# Altium schematic sheet pai.SchDoc: Pai
size Tabloid; DrawnBy: Byrne; DocumentNumber: 1; SheetNumber: 1; SheetTotal: 1
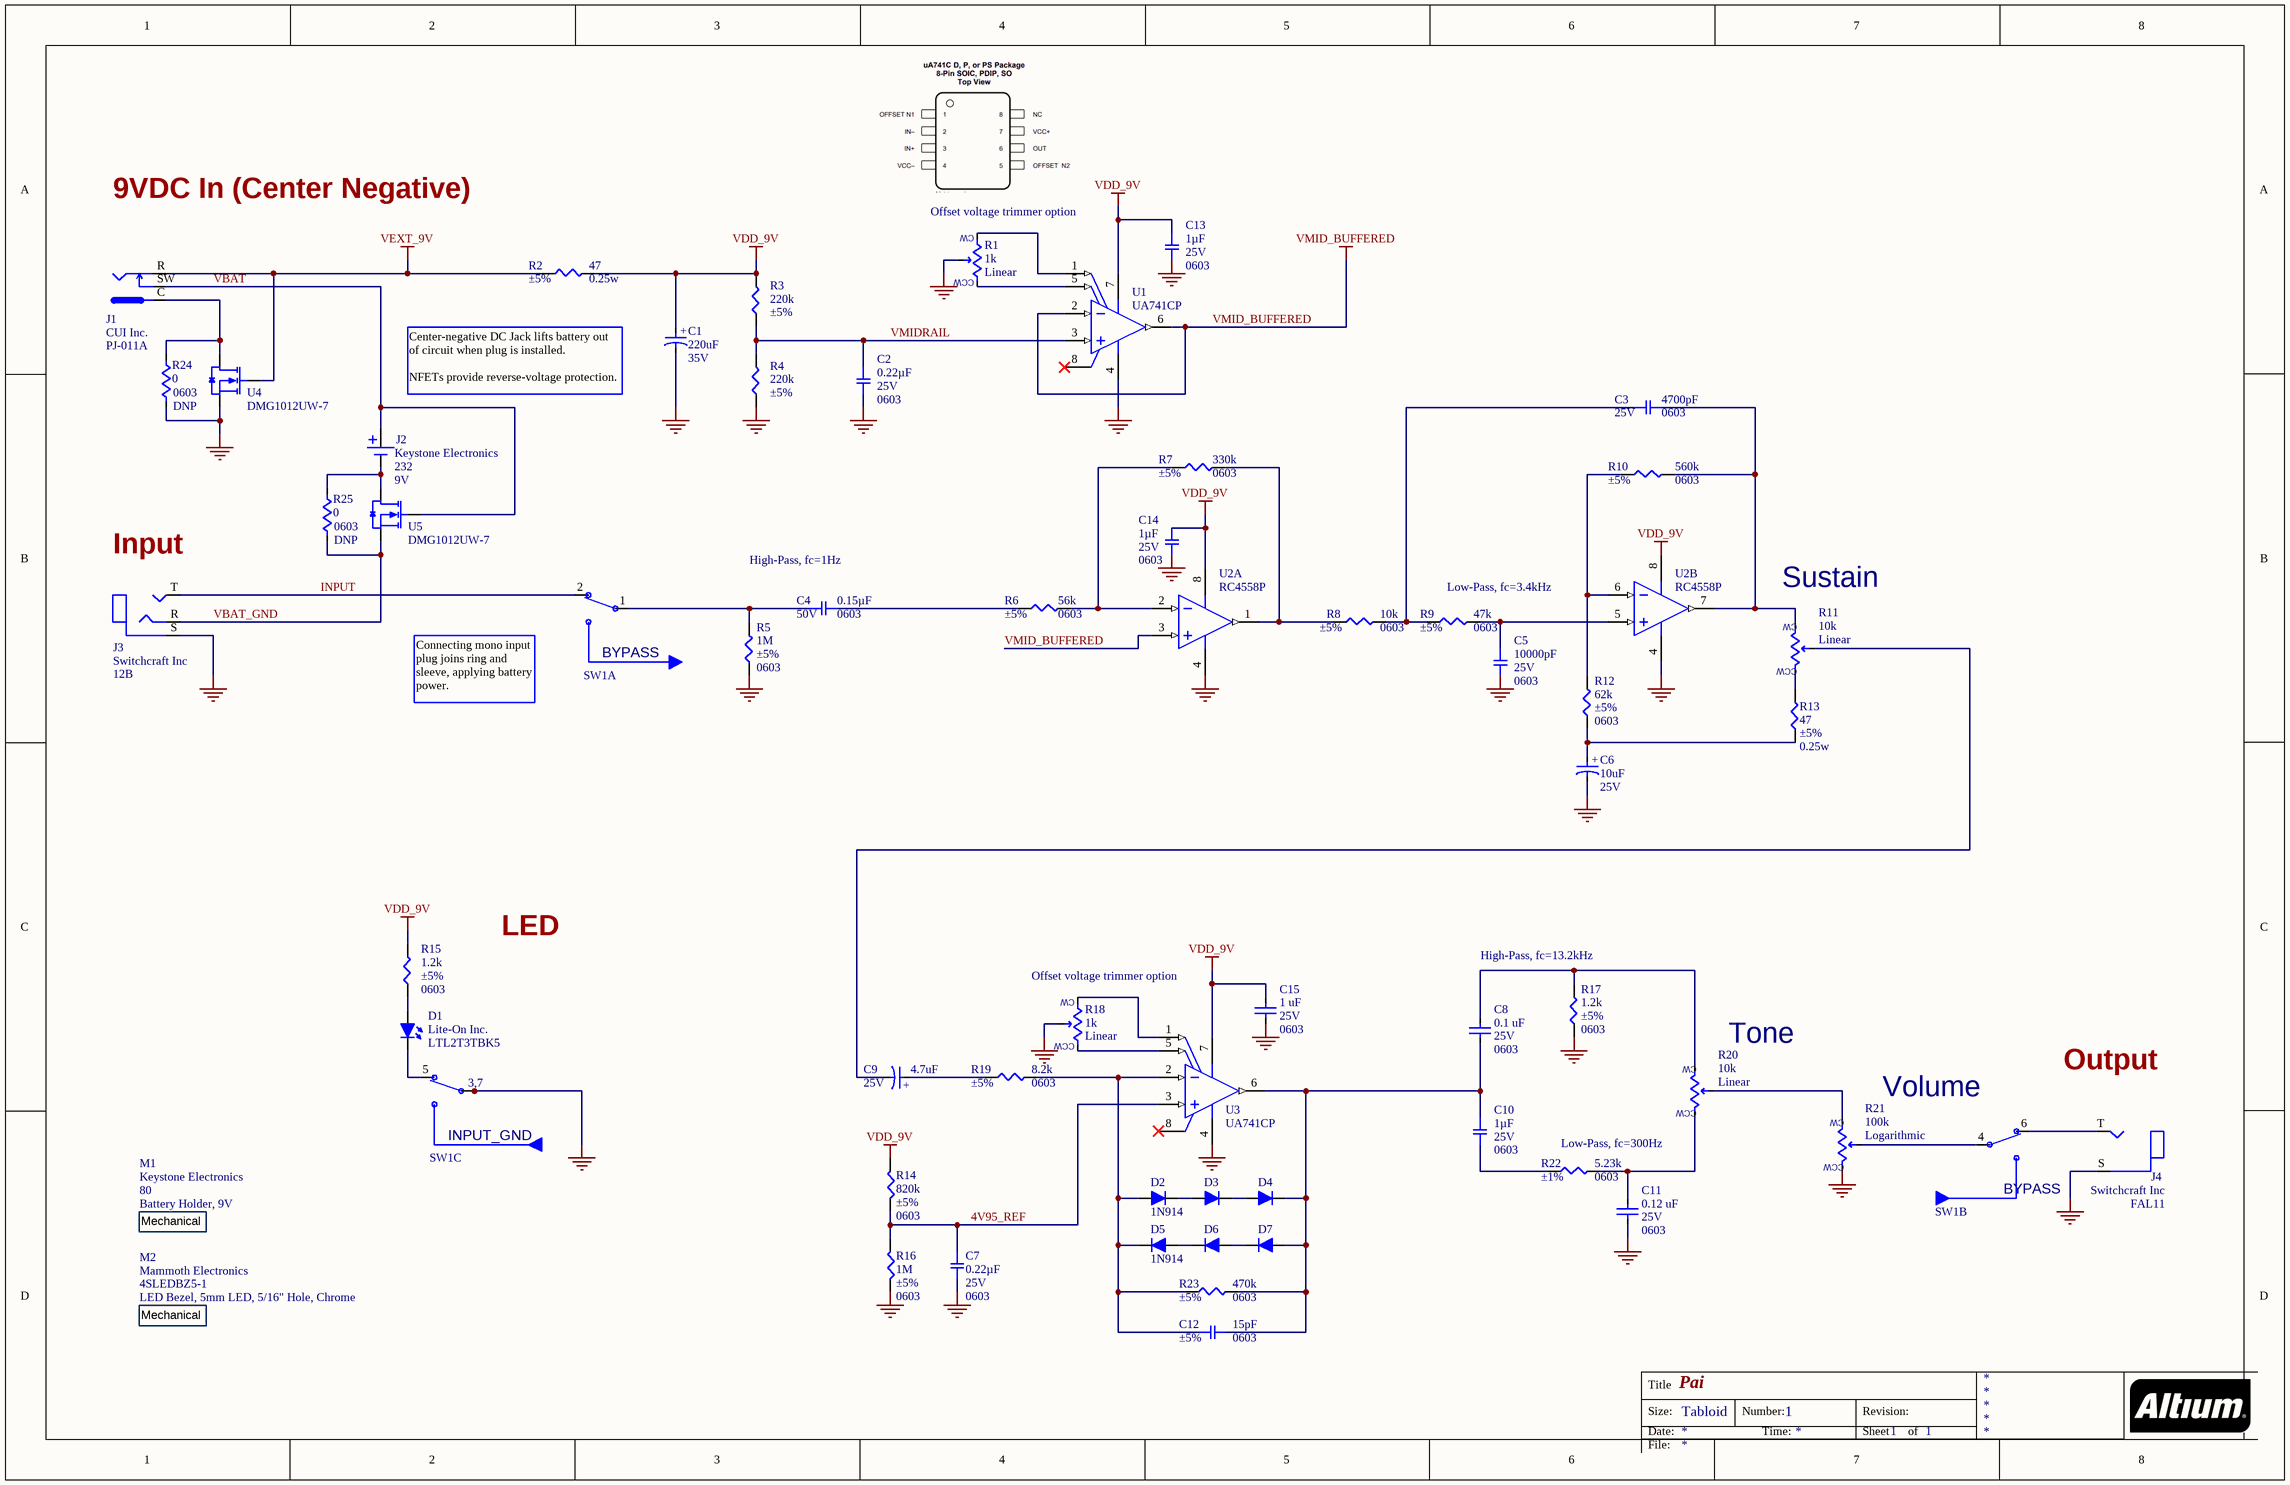
[diagram p0: pai.SchDoc]

## Parts
C1  value 220uF  Voltage-Rated: 35V  [CAP_TH_10X14_L5]  (hidden comment: CAP-POL)
C2  0.22µF  Voltage: 25V  Package / Case: 0603  [SMD-0603C]
C3  4700pF  Voltage: 25V  Package / Case: 0603  [SMD-0603C]
C4  0.15µF  Voltage: 50V  Package / Case: 0603  [SMD-0603C]
C5  10000pF  Voltage: 25V  Package / Case: 0603  [SMD-0603C]
C6  value 10uF  Voltage-Rated: 25V  [CAP_TH_5X12_L5]  (hidden comment: CAP-POL)
C7  0.22µF  Voltage: 25V  Package / Case: 0603  [SMD-0603C]
C8  value 0.1 uF  Voltage-Rated: 25V  Package / Case: 0603  [CAPC1608X09N]  (hidden comment: CAP)
C9  value 4.7uF  Voltage-Rated: 25V  [CAP_TH_5X12_L2]  (hidden comment: CAP-POL)
C10  1µF  Voltage: 25V  Package / Case: 0603  [SMD-0603C]
C11  value 0.12 uF  Voltage-Rated: 25V  Package / Case: 0603  [CAPC1608X09N]  (hidden comment: CAP)
C12  15pF  Tolerance: ±5%  Package / Case: 0603  [SMD-0603C]
C13  1µF  Voltage: 25V  Package / Case: 0603  [SMD-0603C]
C14  1µF  Voltage: 25V  Package / Case: 0603  [SMD-0603C]
C15  value 1 uF  Voltage-Rated: 25V  Package / Case: 0603  [CAPC1608X09N]  (hidden comment: CAP)
D1  Manufacturer 1: Lite-On Inc.  Manufacturer 1 PN: LTL2T3TBK5  [LED_TH_5MM_BLUE]  (hidden comment: LED-Blue)
D2  Manufacturer 1 PN: 1N914  [DO35-2_1N914]  (hidden comment: DIO-GEN)
D3  DIO-GEN  [DO35-2_1N914]  (value not drawn)
D4  DIO-GEN  [DO35-2_1N914]  (value not drawn)
D5  Manufacturer 1 PN: 1N914  [DO35-2_1N914]  (hidden comment: DIO-GEN)
D6  DIO-GEN  [DO35-2_1N914]  (value not drawn)
D7  DIO-GEN  [DO35-2_1N914]  (value not drawn)
J1  Manufacturer 1 PN: PJ-011A  Manufacturer 1: CUI Inc.  [PWR_JACK_SW_HDR]  (hidden comment: PWR_JACK_SW)
J2  Manufacturer 1 PN: 232  Battery Cell Size: 9V  Manufacturer 1: Keystone Electronics  [PWR_JACK_HDR]  (hidden comment: 9V_BATT)
J3  Manufacturer 1 PN: 12B  Manufacturer 1: Switchcraft Inc  [STEREO_JACK_HDR]  (hidden comment: STEREO_JACK)
J4  Manufacturer 1 PN: FAL11  Manufacturer 1: Switchcraft Inc  [MONO_JACK_HDR]  (hidden comment: MONO_JACK)
M1  Manufacturer 1 PN: 80  Manufacturer 1: Keystone Electronics  Desc: Battery Holder, 9V  (hidden comment: MECH)  (mechanical)
M2  Manufacturer 1 PN: 4SLEDBZ5-1  Supplier 1: Mammoth Electronics  (hidden comment: MECH)  (mechanical)
R1  value 1k  Taper: Linear  [POT_TT35W]  (hidden comment: POT)
R2  47  Tolerance: ±5%  Power (Watts): 0.25w  [SMD-0603-RES]
R3  220k  Tolerance: ±5%  [SMD-0603-RES]
R4  220k  Tolerance: ±5%  [SMD-0603-RES]
R5  1M  Tolerance: ±5%  Supplier Device Package: 0603  [SMD-0603-RES]
R6  56k  Tolerance: ±5%  Supplier Device Package: 0603  [SMD-0603-RES]
R7  330k  Tolerance: ±5%  Supplier Device Package: 0603  [SMD-0603-RES]
R8  10k  Tolerance: ±5%  Supplier Device Package: 0603  [SMD-0603-RES]
R9  47k  Tolerance: ±5%  Package / Case: 0603  [SMD-0603-RES]
R10  560k  Tolerance: ±5%  Supplier Device Package: 0603  [SMD-0603-RES]
R11  value 10k  Taper: Linear  [POT_16MM_TH_RA]  (hidden comment: POT)
R12  62k  Tolerance: ±5%  Supplier Device Package: 0603  [SMD-0603-RES]
R13  47  Tolerance: ±5%  Power (Watts): 0.25w  [SMD-0603-RES]
R14  820k  Tolerance: ±5%  Supplier Device Package: 0603  [SMD-0603-RES]
R15  1.2k  Tolerance: ±5%  Package / Case: 0603  [SMD-0603-RES]
R16  1M  Tolerance: ±5%  Supplier Device Package: 0603  [SMD-0603-RES]
R17  1.2k  Tolerance: ±5%  Supplier Device Package: 0603  [SMD-0603-RES]
R18  value 1k  Taper: Linear  [POT_TT35W]  (hidden comment: POT)
R19  8.2k  Tolerance: ±5%  Supplier Device Package: 0603  [SMD-0603-RES]
R20  value 10k  Taper: Linear  [POT_16MM_TH_RA]  (hidden comment: POT)
R21  value 100k  Taper: Logarithmic  [POT_16MM_TH_RA]  (hidden comment: POT)
R22  5.23k  Tolerance: ±1%  Supplier Device Package: 0603  [SMD-0603-RES]
R23  470k  Tolerance: ±5%  Supplier Device Package: 0603  [SMD-0603-RES]
R24  value 0  Package: 0603  [RESC1508X09N]  (hidden comment: RES)  (no BOM)
R25  value 0  Package: 0603  [RESC1508X09N]  (hidden comment: RES)  (no BOM)
SW1  3PDT_SW_SOLDERBOARD  (value not drawn)  (parts A,B,C of 3)
U1  UA741CP  [TI-P8]
U2  RC4558P  [TI-P8]  (parts A,B of 2)
U3  UA741CP  [TI-P8]
U4  Manufacturer Part Number: DMG1012UW-7  [SOT65P205X110-3N_DMG1012UW-7]  (hidden comment: NFET_SOT323)
U5  Manufacturer Part Number: DMG1012UW-7  [SOT65P205X110-3N_DMG1012UW-7]  (hidden comment: NFET_SOT323)

## Nets
GND: C1.2 C2.2 C5.2 C6.2 C7.2 C11.2 C13.2 C14.2 C15.2 J3.S J4.S R1.2 R4.1 R5.1 R16.1 R17.1 R18.2 R21.1 R24.1 SW1.3 SW1.7 U1.4(VCC-) U2.4(VCC-) U3.4(VCC-) U4.S
VDD_9V: C1.1 C13.1 C14.1 C15.1 R2.2 R3.2 R14.2 R15.2 U1.7(VCC+) U2.8(VCC+) U3.7(VCC+)
VEXT_9V: J1.R R2.1 U4.G
VMID_BUFFERED: U1.2(IN-) U1.6(OUT) U2.3(IN1+)
4V95_REF: C7.1 R14.1 R16.2 U3.3(IN+)
INPUT: J3.T SW1.2
VBAT: J1.SW J2.1 U5.G
VBAT_GND: J3.R R25.1 U5.S
VMIDRAIL: C2.1 R3.1 R4.2 U1.3(IN+)
NetC3_1: C3.1 R8.2 R9.1
NetC3_2: C3.2 R10.2 R11.3 U2.7(OUT2)
NetC4_1: C4.1 R5.2 SW1.1
NetC4_2: C4.2 R6.1
NetC5_1: C5.1 R9.2 U2.5(IN2+)
NetC6_1: C6.1 R12.1 R13.1
NetC8_1: C8.1 R17.2 R20.3
NetC8_2: C8.2 C10.1 C12.2 D4.K D7.A R23.2 U3.6(OUT)
NetC9_1: C9.1 R19.1
NetC9_2: C9.2 R11.2
NetC10_2: C10.2 R22.1
NetC11_1: C11.1 R20.1 R22.2
NetC12_1: C12.1 D2.A D5.K R19.2 R23.1 U3.2(IN-)
NetD1_A: D1.A R15.1
NetD1_K: D1.K SW1.5
NetD2_K: D2.K D3.A
NetD3_K: D3.K D4.A
NetD5_A: D5.A D6.K
NetD6_A: D6.A D7.K
NetJ1_C: J1.C R24.2 U4.D
NetJ2_2: J2.2 R25.2 U5.D
NetJ4_T: J4.T SW1.6
NetR1_1: R1.1 U1.5(OFFSET_N2)
NetR1_3: R1.3 U1.1(OFFSET_N1)
NetR6_2: R6.2 R7.1 U2.2(IN1-)
NetR7_2: R7.2 R8.1 U2.1(OUT1)
NetR10_1: R10.1 R12.2 U2.6(IN2-)
NetR11_1: R11.1 R13.2
NetR18_1: R18.1 U3.5(OFFSET_N2)
NetR18_3: R18.3 U3.1(OFFSET_N1)
NetR20_2: R20.2 R21.3
NetR21_2: R21.2 SW1.4

Not connected (* = marked no-connect by the designer): U1 8(NC)*; U3 8(NC)*

## Notes on the sheet
- 9VDC In (Center Negative)
- (near R1) Offset voltage trimmer option
- Center-negative DC Jack lifts battery out of circuit when plug is installed.
  NFETs provide reverse-voltage protection.
- (near J3) Input
- (near C4) High-Pass, fc=1Hz
- (near R9) Low-Pass, fc=3.4kHz
- (near R11) Sustain
- Connecting mono input plug joins ring and sleeve, applying battery power.
- LED
- (near R17) High-Pass, fc=13.2kHz
- (near R18) Offset voltage trimmer option
- (near R20) Tone
- Volume
- Output
- (near R22) Low-Pass, fc=300Hz
- Title
- Size:
- Date:
- Tabloid
- Number:
- Time:
- Revision:
- Sheet
- of
- File:
- (in symbol 3PDT_SW_SOLDERBOARD, part A) BYPASS
- (in symbol 3PDT_SW_SOLDERBOARD, part B) BYPASS
- (in symbol 3PDT_SW_SOLDERBOARD, part C) 3,7; INPUT_GND
- (in symbol CAP-TH-0001) +
- (in symbol CAP-TH-0002) +
- (in symbol CAP-TH-0003) +
- (in symbol MECH-0001) Mechanical
- (in symbol MECH-0002) Mechanical
- (in symbol POT-0004) CW; CCW
- (in symbol POT-0017) CW; CCW
- (in symbol POT-0021) CW; CCW

## Library data of the parts
C1 = CAP-TH-0002: CAP ALUM 220UF 20% 35V THRU HOLE; Manufacturer 1: KEMET; Manufacturer 1 PN: ESH227M035AH9AA; Lifetime @ Temp: 2000; Polarization: Polar; Ripple Current @ Low Frequency: 315Ma @ 120Hz; Ripple Current @ High Frequency: 472.5mA @ 10kHz; TPN: CAP-TH-0002; Tolerance: 20%; ESR: -; Operating Temperature: -40°C ~ 105°C; Lead Spacing: 0.197" (5.00mm); Size / Dimension: 0.394" Dia (10.00mm); Height - Seated (Max): 0.551" (14.00mm); Mounting Type: Through Hole; Package / Case: Radial, Can; Supplier 1: Digi-Key; Supplier 1 PN: 399-15681-ND; Supplier 1 Link: https://www.digikey.com/product-detail/en/kemet/ESH227M035AH9AA/399-15681-ND/7423187
C2 C7 = GRM188R71E224KA88D: CAP CER 0.22UF 25V X7R 0603; Manufacturer: Murata Electronics North America; Factory Stock: 0; Unit Price (USD): 0.14; Minimum Quantity: 1; Tolerance: ±10%; Part Number: GRM188R71E224KA88D; Datasheets: http://www.murata.com/~/media/webrenewal/support/library/catalog/products/capacitor/mlcc/c02e.pdf; Image: //media.digikey.com/Renders/Murata%20Renders/ZRB-SERIES-0402.jpg; Digi-Key Part Number: 490-3290-1-ND; Quantity Available: 323168; @ qty: 0; Packaging: Cut Tape (CT); Series: GRM; Part Status: Active; Value: 0.22µF; Temperature Coefficient: X7R; Operating Temperature: -55°C ~ 125°C; Features: -; Ratings: -; Applications: General Purpose; Mounting Type: Surface Mount, MLCC; Size / Dimension: 0.063" L x 0.031" W (1.60mm x 0.80mm); Height - Seated (Max): -; Thickness (Max): 0.035" (0.90mm); Lead Spacing: -; Lead Style: -
C3 = GCM188R71E472KA37D: CAP CER 4700PF 25V X7R 0603; Manufacturer: Murata Electronics North America; Factory Stock: 0; Unit Price (USD): 0.1; Minimum Quantity: 1; Tolerance: ±10%; Part Number: GCM188R71E472KA37D; Datasheets: http://www.murata.com/~/media/webrenewal/support/library/catalog/products/capacitor/mlcc/c03e.ashx; Image: //media.digikey.com/Renders/Murata%20Renders/0603%28GCM188%29.jpg; Digi-Key Part Number: 490-11959-1-ND; Quantity Available: 3228; @ qty: 0; Packaging: Cut Tape (CT); Series: GCM; Part Status: Active; Value: 4700pF; Temperature Coefficient: X7R; Operating Temperature: -55°C ~ 125°C; Features: -; Ratings: AEC-Q200; Applications: Automotive; Mounting Type: Surface Mount, MLCC; Size / Dimension: 0.063" L x 0.031" W (1.60mm x 0.80mm); Height - Seated (Max): -; Thickness (Max): 0.035" (0.90mm); Lead Spacing: -; Lead Style: -
C4 = GCM188R71H154KA64D: CAP CER 0.15UF 50V X7R 0603; Manufacturer: Murata Electronics North America; Factory Stock: 0; Unit Price (USD): 0.19; Minimum Quantity: 1; Tolerance: ±10%; Part Number: GCM188R71H154KA64D; Datasheets: http://www.murata.com/~/media/webrenewal/support/library/catalog/products/capacitor/mlcc/c03e.ashx; Image: //media.digikey.com/Renders/Murata%20Renders/0603%28GCM188%29.jpg; Digi-Key Part Number: 490-11960-1-ND; Quantity Available: 3950; @ qty: 0; Packaging: Cut Tape (CT); Series: GCM; Part Status: Active; Value: 0.15µF; Temperature Coefficient: X7R; Operating Temperature: -55°C ~ 125°C; Features: -; Ratings: AEC-Q200; Applications: Automotive; Mounting Type: Surface Mount, MLCC; Size / Dimension: 0.063" L x 0.031" W (1.60mm x 0.80mm); Height - Seated (Max): -; Thickness (Max): 0.035" (0.90mm); Lead Spacing: -; Lead Style: -; Parameter 1: *
C5 = GRM188R71E103KA01J: CAP CER 10000PF 25V X7R 0603; Manufacturer: Murata Electronics North America; Factory Stock: 0; Unit Price (USD): 0.1; Minimum Quantity: 1; Tolerance: ±10%; Part Number: GRM188R71E103KA01J; Datasheets: http://www.murata.com/~/media/webrenewal/support/library/catalog/products/capacitor/mlcc/c02e.pdf; Image: //media.digikey.com/Renders/Murata%20Renders/ZRB-SERIES-0402.jpg; Digi-Key Part Number: 490-11997-1-ND; Quantity Available: 8531; @ qty: 0; Packaging: Cut Tape (CT); Series: GRM; Part Status: Active; Value: 10000pF; Temperature Coefficient: X7R; Operating Temperature: -55°C ~ 125°C; Features: -; Ratings: -; Applications: General Purpose; Mounting Type: Surface Mount, MLCC; Size / Dimension: 0.063" L x 0.031" W (1.60mm x 0.80mm); Height - Seated (Max): -; Thickness (Max): 0.035" (0.90mm); Lead Spacing: -; Lead Style: -
C6 = CAP-TH-0001: CAP ALUM 10UF 20% 25V RADIAL; Manufacturer 1: Panasonic Electronic Components; Manufacturer 1 PN: ECA-1EM100B; Lifetime @ Temp: 2000; Polarization: Polar; Ripple Current @ Low Frequency: 50mA @ 120Hz; Ripple Current @ High Frequency: 85mA @ 10kHz; TPN: CAP-TH-0001; Tolerance: 20%; ESR: -; Operating Temperature: -40°C ~ 85°C; Lead Spacing: 0.197" (5.00mm); Size / Dimension: 0.197" Dia (5.00mm)); Height - Seated (Max): 0.472" (12.00mm); Mounting Type: Through Hole; Package / Case: Radial, Can; Supplier 1: Digi-Key; Supplier 1 PN: P19522CT-ND; Supplier 1 Link: https://www.digikey.com/product-detail/en/panasonic-electronic-components/ECA-1EM100B/P19522CT-ND/6109420
C8 = CAP-SMT-0001: CAP CER 0.1UF 25V X5R 0603; Manufacturer 1: Samsung Electro-Mechanics; Manufacturer Part Number 1: CL10A104KA8NNNC; Tolerance: 20%; TPN: CAP-SMT-0001; Temperature Coefficient: X5R; Operating Temperature: -55°C ~ 85°C; Size / Dimension: 0.063" L x 0.031" W (1.60mm x 0.80mm); Supplier 1: Digi-Key; Supplier Part Number 1: 1276-1857-1-ND; Supplier Link 1: http://www.samsungsem.com/kr/support/product-search/mlcc/CL10A104KA8NNNC.jsp; Manufacturer 2: Taiyo Yuden; Manufacturer Part Number 2: EMK107BJ104KAHT; Supplier 2: Digi-Key; Supplier Part Number 2: 587-3308-1-ND
C9 = CAP-TH-0003: CAP ALUM 4.7UF 20% 25V RADIAL; Manufacturer 1: Wurth Electronics Inc.; Manufacturer 1 PN: 860020472001; Lifetime @ Temp: 2000; Polarization: Polar; Ripple Current @ Low Frequency: 26mA @ 120Hz; Ripple Current @ High Frequency: 44.2mA @ 100kHz; TPN: CAP-TH-0003; Tolerance: 20%; ESR: -; Operating Temperature: -40°C ~ 105°C; Lead Spacing: 0.079" (2.00mm); Size / Dimension: 0.1o97" Dia (5.00mm); Height - Seated (Max): 0.492"(12.5mm); Mounting Type: Through Hole; Package / Case: Radial, Can; Supplier 1: Digi-Key; Supplier 1 PN: 732-8818-1-ND; Supplier 1 Link: https://www.digikey.com/product-detail/en/wurth-electronics-inc/860020472001/732-8818-1-ND/5728763
C10 C13 C14 = GRM188R71E105KA12D: CAP CER 1UF 25V X7R 0603; Manufacturer: Murata Electronics North America; Factory Stock: 0; Unit Price (USD): 0.24; Minimum Quantity: 1; Tolerance: ±10%; Part Number: GRM188R71E105KA12D; Datasheets: http://www.murata.com/~/media/webrenewal/support/library/catalog/products/capacitor/mlcc/c02e.pdf; Image: //media.digikey.com/Renders/Murata%20Renders/ZRB-SERIES-0402.jpg; Digi-Key Part Number: 490-5307-1-ND; Quantity Available: 513860; @ qty: 0; Packaging: Cut Tape (CT); Series: GRM; Part Status: Active; Value: 1µF; Temperature Coefficient: X7R; Operating Temperature: -55°C ~ 125°C; Features: -; Ratings: -; Applications: General Purpose; Mounting Type: Surface Mount, MLCC; Size / Dimension: 0.063" L x 0.031" W (1.60mm x 0.80mm); Height - Seated (Max): -; Thickness (Max): 0.035" (0.90mm); Lead Spacing: -; Lead Style: -
C11 = CAP-SMT-0002: CAP CER 0.12UF 25V X7R 0603; Manufacturer 1: Kemet; Manufacturer Part Number 1: C0603C124K3RAC7867; Tolerance: 10%; TPN: CAP-SMT-0002; Temperature Coefficient: X7R; Operating Temperature: -55°C ~ 125°C; Size / Dimension: 0.063" L x 0.031" W (1.60mm x 0.80mm); Supplier 1: Digi-Key; Supplier Part Number 1: 399-14951-1-ND; Supplier Link 1: https://api.kemet.com/component-edge/download/datasheet/C0603C124K3RAC7867.pdf
C12 = GCM1885C1H150JA16D: CAP CER 15PF 50V NP0 0603; Manufacturer: Murata Electronics North America; Factory Stock: 0; Unit Price (USD): 0.1; Minimum Quantity: 1; Temperature Coefficient: C0G, NP0; Part Number: GCM1885C1H150JA16D; Datasheets: http://www.murata.com/~/media/webrenewal/support/library/catalog/products/capacitor/mlcc/c03e.ashx; Image: //media.digikey.com/Renders/Murata%20Renders/0603%28GCM188%29.jpg; Digi-Key Part Number: 490-4957-1-ND; Quantity Available: 99209; @ qty: 0; Packaging: Cut Tape (CT); Series: GCM; Part Status: Active; Value: 15pF; Voltage: 50V; Operating Temperature: -55°C ~ 125°C; Features: -; Ratings: AEC-Q200; Applications: Automotive; Mounting Type: Surface Mount, MLCC; Size / Dimension: 0.063" L x 0.031" W (1.60mm x 0.80mm); Height - Seated (Max): -; Thickness (Max): 0.035" (0.90mm); Lead Spacing: -; Lead Style: -
C15 = CAP-SMT-0003: CAP CER 1UF 25V X5R 0603; Manufacturer 1: Samsung Electro-Mechanics; Manufacturer Part Number 1: CL10A15KA5LNNC; Tolerance: 10%; TPN: CAP-SMT-0003; Temperature Coefficient: X5R; Operating Temperature: -55°C ~ 85°C; Size / Dimension: 0.063" L x 0.031" W (1.60mm x 0.80mm); Supplier 1: Digi-Key; Supplier Part Number 1: 1276-1858-1-ND; Supplier Link 1: http://www.samsungsem.com/kr/support/product-search/mlcc/CL10A105KA5LNNC.jsp; Manufacturer 2: Taiyo Yuden; Manufacturer Part Number 2: TMK107B7105KA-T; Supplier 2: Digi-Key; Supplier Part Number 2: 587-2984-1-ND
D1 = LED-0003: LED BLUE CLEAR T-1 3/4 T/H; Configuration: Standard; Lens Color: Colorless; Millicandela Rating: 1200mcd; Lens Style: Round with Domed Top; Lens Size: 5mm, T-1 3/4; Voltage - Forward (Vf) (Typ): 3.5V; Current - Test: 20mA; Viewing Angle: 30°; Wavelength - Dominant: 470nm; Wavelength - Peak: 468nm; TPN: LED-0003; Color: Blue; Lens Transparency: Clear; Mounting Type: Through Hole; Features: -; Package / Case: Radial; Supplier Device Package: T-1 3/4; Size / Dimension: -; Height (Max): 8.70mm; Supplier 1: Digi-Key; Supplier 1 PN: 160-1610-ND; Supplier 1 Link: https://www.digikey.com/product-detail/en/lite-on-inc/LTL2T3TBK5/160-1610-ND/573515
D2 D5 = DIO-GEN-0001: DIODE GEN PURP 75V 200MA DO35; Manufacturer 1: Microsemi Corporation; Voltage - Forward (Vf) (Max) @ If: 1.2V @ 50mA; Speed: Small Signal =< 200mA (Io), Any Speed; Current - Reverse Leakage @ Vr: 500nA @ 75V; Capacitance @ Vr, F: 4pF @ 0V, 1MHz; TPN: DIO-GEN-0001; Voltage - DC Reverse (Vr) (Max): 75V; Current - Average Rectified (Io): 200mA; Mounting Type: Through Hole; Package / Case: DO-204AH, DO-35, Axial; Supplier Device Packaging: DO-35 (DO-204AH); Operating Temperature - Junction: -65°C ~ 175°C; Supplier 1: Digi-Key; Supplier 1 PN: 1N914MS-ND; Supplier 1 Link: https://www.digikey.com/product-detail/en/microsemi-corporation/1N914/1N914MS-ND/4377361
D3 D4 D6 D7 = DIO-GEN-0001: DIODE GEN PURP 75V 200MA DO35; Manufacturer 1 PN: 1N914; Manufacturer 1: Microsemi Corporation; Voltage - Forward (Vf) (Max) @ If: 1.2V @ 50mA; Speed: Small Signal =< 200mA (Io), Any Speed; Current - Reverse Leakage @ Vr: 500nA @ 75V; Capacitance @ Vr, F: 4pF @ 0V, 1MHz; TPN: DIO-GEN-0001; Voltage - DC Reverse (Vr) (Max): 75V; Current - Average Rectified (Io): 200mA; Mounting Type: Through Hole; Package / Case: DO-204AH, DO-35, Axial; Supplier Device Packaging: DO-35 (DO-204AH); Operating Temperature - Junction: -65°C ~ 175°C; Supplier 1: Digi-Key; Supplier 1 PN: 1N914MS-ND; Supplier 1 Link: https://www.digikey.com/product-detail/en/microsemi-corporation/1N914/1N914MS-ND/4377361
J1 = PWR-CN-0001: CONN PWR JACK 2X5.5MM SOLDER; Gender: Male; Industry Recognized Mating Diamter: 2.10mm ID (0.083"), 5.50mm OD (0.217"); Actual Diameter: 0.079" (2.00mm ID), 0.236" (6.00mm OD); Number of Positions/Contacts: 2 Conductors, 3 Contacts; Internal Switch(s): Single Switch, Normally Closed; Shielding: Unshielded; Voltage - Rated: 12VDC; Current Rating: 2A; Includes: 2 pcs - 1 Connector, 1 Nut; Body Color: Black; Material Flammability Rating: UL94 V-0; TPN: PWR-CN-0001; Connector Type: Jack; Mounting Type: Panel Mount; Mounting Feature: Bulkhead - Front Side Nut; Termination: Solder Eyelet(s); Features: Mounting Hardware, Thread Lock; Insulation Color: -; Mating Length / Depth: -; Ingress Protection: -; Contact Material - Plating: Nickel; Body Material: -; Operating Temperature: -; Housing Material: Polyoxymethylene (POM); Contact Material: Brass; Copper Alloy; Thread Size: -; Supplier 1: Digi-Key; Supplier 1 PN: CP-011A-ND; Supplier 1 Link: https://www.digikey.com/product-detail/en/cui-inc/PJ-011A/CP-011A-ND/305540
J2 = BATT-0001: BATTERY CONNECT SNAP 9V 4" LEADS; Battery Type Function: 9; Style: Connector, Snap; Number of Cells: 1; TPN: BATT-0001; Battery Series: -; Mounting Type: Free Hanging; Termination Style: Wire Leads - 4" (101.6mm); Height Above Board: -; Operating Temperature: -; Supplier 1: Digi-Key; Supplier 1 PN: 36-232-ND; Supplier 1 Link: https://www.digikey.com/product-detail/en/keystone-electronics/232/36-232-ND/303804
J3 = AUD-CN-0001: CONN JACK STEREO 6.35MM PNL MNT; Manufacturer 2 PN: JK100S; Connector Type: Phone Jack; Gender: Female; Singal Lines: Stereo (3 Conductor, TRS); Industry Recognized Mating Diameter: 6.35mm (0.250", 1/4") - Headphone; Actual Diameter: 0.25" (6.35mm); Number of Positions/Contacts: 3 Conductors, 3 Contacts; Internal Switch(s): Does Not Contain Switch; Shielding: Unshielded; Voltage - Rated: 25VDC; Current Rating: 1A; Body Material: Copper Alloy; Body Color: Silver; Includes: 3 pcs - 1 Connector, 1 Nut, 1 Washer; Panel Hole Size: 0.375" (9.52mm); Thread Size: 3/8"-32; TPN: AUD-CN-0001; Series: LITTLE-JAX; Mounting Type: Panel Mount, Through Hole; Termination: Solder Eyelet(s); Features: Mounting Hardware, Thread Lock; Insulation Color: -; mating Length/Depth: -; Contact Material - Plating: Nickel; Housing Material: -; Contact Material: Copper Alloy; Cable Opening: -; Operating Temperature: -20°C ~ 65°C; Supplier 1: Digi-Key; Supplier 1 PN: SC1094-ND; Supplier 1 Link: https://www.digikey.com/product-detail/en/switchcraft-inc/12B/SC1094-ND/109541; Manufacturer 2: Mammoth Electronics; Supplier 2: https://www.mammothelectronics.com/collections/audio-jacks/products/4sjk100s
J4 = AUD-CN-0002: CONN JACK MONO 6.35MM PNL MNT; Manufacturer 2 PN: JK100M; Connector Type: Phone Jack; Gender: Female; Industry Recognized Mating Diameter: 6.35mm (0.250", 1/4") - Headphone; Actual Diameter: 0.25" (6.35mm); Number of Positions/Contacts: 2 Conductors, 2 Contacts; Internal Switch(s): Does Not Contain Switch; Shielding: Unshielded; Voltage - Rated: 25VDC; Current Rating: 1A; Body Material: Copper Alloy; Body Color: Silver; Includes: 3 pcs - 1 Connector, 1 Nut, 1 Washer; Panel Hole Size: 0.375" (9.52mm); Thread Size: 3/8"-32; TPN: AUD-CN-0002; Series: LITTLE-JAX; Singal Lines: Mono; Mounting Type: Panel Mount, Through Hole; Termination: Solder Eyelet(s); Features: Mounting Hardware, Thread Lock; Insulation Color: -; mating Length/Depth: -; Contact Material - Plating: Nickel; Housing Material: -; Contact Material: Copper Alloy; Cable Opening: -; Operating Temperature: -20°C ~ 65°C; Supplier 1: Digi-Key; Supplier 1 PN: SC1847-ND; Supplier 1 Link: https://www.digikey.com/product-detail/en/switchcraft-inc/FAL11/SC1847-ND/1289066; Manufacturer 2: Mammoth Electronics; Supplier 2: https://www.mammothelectronics.com/collections/audio-jacks/products/4sjk100m
M1 = MECH-0001: BATTERY HOLDER CLIP 9V; TPN: MECH-0001; Supplier 1: Digi-Key; Supplier 1 PN: 36-80-ND; Supplier 1 Link: https://www.digikey.com/product-detail/en/keystone-electronics/80/36-80-ND/2745547
M2 = MECH-0002: LED Bezel, 5mm LED, 5/16" Hole, Chrome; TPN: MECH-0002; Manufacturer 1: Mammoth Electronics; Supplier 1 PN: 4SLEDBZ5-1; Supplier 1 Link: https://www.mammothelectronics.com/collections/led-bezels/products/4sledbz5-1; Desc: LED Bezel, 5mm LED, 5/16" Hole, Chrome
R1 R18 = POT-0021: Potentiometer, 1k, Linear Taper, Trim, Single Gang, Surface Mount; Manufacturer 1: TT Elecronics/Bl; Manufacturer 1 PN: 35WR1KLFTR; Tolerance: 25%; Power (Watts): 0.1; Temperature Coefficient: ±250ppm/°C; TPN: POT-0021; Size / Dimension: Rectangular - 0.144" x 0.118" Face x 0.067" H (3.65mm x 3.00mm x 1.70mm); Mounting Type: Surface Mount; Supplier 1: Digi-Key; Supplier Part Number 1: 987-1812-1-ND; Supplier Link 1: https://www.digikey.com/product-detail/en/tt-electronics-bi/35WR1KLFTR/987-1812-1-ND/8111752
R2 R13 = ERJ-PA3J470V: RES SMD 47 OHM 5% 1/4W 0603; Manufacturer: Panasonic Electronic Components; Factory Stock: 0; Unit Price (USD): 0.01646; @ qty: 1500; Minimum Quantity: 1; Temperature Coefficient: ±200ppm/°C; Part Number: ERJ-PA3J470V; Datasheets: https://industrial.panasonic.com/cdbs/www-data/pdf/RDA0000/AOA0000C243.pdf; Image: //media.digikey.com/Photos/Panasonic%20Photos/MFG_ERJ-P6W%20Series.jpg; Digi-Key Part Number: P47.00BZCT-ND; Quantity Available: 4817; Packaging: Cut Tape (CT); Series: ERJ; Part Status: Active; Value: 47; Composition: Thick Film; Features: Automotive AEC-Q200, Pulse Withstanding; Operating Temperature: -55°C ~ 155°C; Package / Case: 0603 (1608 Metric); Supplier Device Package: 0603; Size / Dimension: 0.063" L x 0.031" W (1.60mm x 0.80mm); Height - Seated (Max): 0.022" (0.55mm); Number of Terminations: 2; Failure Rate: -
R3 = ERJ-PA3J224V: RES SMD 220K OHM 5% 1/4W 0603; Manufacturer: Panasonic Electronic Components; Factory Stock: 0; Unit Price (USD): 0.01646; @ qty: 1500; Minimum Quantity: 1; Power (Watts): 0.25W; Temperature Coefficient: ±200ppm/°C; Part Number: ERJ-PA3J224V; Datasheets: https://industrial.panasonic.com/cdbs/www-data/pdf/RDA0000/AOA0000C243.pdf; Image: //media.digikey.com/Photos/Panasonic%20Photos/MFG_ERJ-P6W%20Series.jpg; Digi-Key Part Number: P220KBZCT-ND; Quantity Available: 19215; Packaging: Cut Tape (CT); Series: ERJ; Part Status: Active; Value: 220k; Composition: Thick Film; Features: Automotive AEC-Q200, Pulse Withstanding; Operating Temperature: -55°C ~ 155°C; Package / Case: 0603 (1608 Metric); Supplier Device Package: 0603; Size / Dimension: 0.063" L x 0.031" W (1.60mm x 0.80mm); Height - Seated (Max): 0.022" (0.55mm); Number of Terminations: 2; Failure Rate: -
R4 = ERJ-PA3J224V: RES SMD 220K OHM 5% 1/4W 0603; Manufacturer: Panasonic Electronic Components; Factory Stock: 0; Unit Price (USD): 0.01646; @ qty: 1500; Minimum Quantity: 1; Power (Watts): 0.25W, 1/4W; Temperature Coefficient: ±200ppm/°C; Part Number: ERJ-PA3J224V; Datasheets: https://industrial.panasonic.com/cdbs/www-data/pdf/RDA0000/AOA0000C243.pdf; Image: //media.digikey.com/Photos/Panasonic%20Photos/MFG_ERJ-P6W%20Series.jpg; Digi-Key Part Number: P220KBZCT-ND; Quantity Available: 19215; Packaging: Cut Tape (CT); Series: ERJ; Part Status: Active; Value: 220k; Composition: Thick Film; Features: Automotive AEC-Q200, Pulse Withstanding; Operating Temperature: -55°C ~ 155°C; Package / Case: 0603 (1608 Metric); Supplier Device Package: 0603; Size / Dimension: 0.063" L x 0.031" W (1.60mm x 0.80mm); Height - Seated (Max): 0.022" (0.55mm); Number of Terminations: 2; Failure Rate: -
R5 R16 = ERJ-3GEYJ105V: RES SMD 1M OHM 5% 1/10W 0603; Manufacturer: Panasonic Electronic Components; Factory Stock: 0; Unit Price (USD): 0.00321; @ qty: 1500; Minimum Quantity: 1; Power (Watts): 0.1W, 1/10W; Temperature Coefficient: ±200ppm/°C; Part Number: ERJ-3GEYJ105V; Datasheets: http://industrial.panasonic.com/www-cgi/jvcr13pz.cgi?E+PZ+3+AOA0001+ERJ3GEYJ105V+7+WW; Image: //media.digikey.com/Photos/Panasonic%20Photos/MFG_ERJ-P6W%20Series.jpg; Digi-Key Part Number: P1.0MGCT-ND; Quantity Available: 250051; Packaging: Cut Tape (CT); Series: ERJ; Part Status: Active; Value: 1M; Composition: Thick Film; Features: Automotive AEC-Q200; Operating Temperature: -55°C ~ 155°C; Package / Case: 0603 (1608 Metric); Size / Dimension: 0.063" L x 0.031" W (1.60mm x 0.80mm); Height - Seated (Max): 0.022" (0.55mm); Number of Terminations: 2; Failure Rate: -
R6 = ERJ-3GEYJ563V: RES SMD 56K OHM 5% 1/10W 0603; Manufacturer: Panasonic Electronic Components; Factory Stock: 0; Unit Price (USD): 0.00321; @ qty: 1500; Minimum Quantity: 1; Power (Watts): 0.1W, 1/10W; Temperature Coefficient: ±200ppm/°C; Part Number: ERJ-3GEYJ563V; Datasheets: http://industrial.panasonic.com/www-cgi/jvcr13pz.cgi?E+PZ+3+AOA0001+ERJ3GEYJ563V+7+WW; Image: //media.digikey.com/Photos/Panasonic%20Photos/MFG_ERJ-P6W%20Series.jpg; Digi-Key Part Number: P56KGCT-ND; Quantity Available: 76734; Packaging: Cut Tape (CT); Series: ERJ; Part Status: Active; Value: 56k; Composition: Thick Film; Features: Automotive AEC-Q200; Operating Temperature: -55°C ~ 155°C; Package / Case: 0603 (1608 Metric); Size / Dimension: 0.063" L x 0.031" W (1.60mm x 0.80mm); Height - Seated (Max): 0.022" (0.55mm); Number of Terminations: 2; Failure Rate: -
R7 = ERJ-3GEYJ334V: RES SMD 330K OHM 5% 1/10W 0603; Manufacturer: Panasonic Electronic Components; Factory Stock: 0; Unit Price (USD): 0.00321; @ qty: 1500; Minimum Quantity: 1; Power (Watts): 0.1W, 1/10W; Temperature Coefficient: ±200ppm/°C; Part Number: ERJ-3GEYJ334V; Datasheets: http://industrial.panasonic.com/www-cgi/jvcr13pz.cgi?E+PZ+3+AOA0001+ERJ3GEYJ334V+7+WW; Image: //media.digikey.com/Photos/Panasonic%20Photos/MFG_ERJ-P6W%20Series.jpg; Digi-Key Part Number: P330KGCT-ND; Quantity Available: 347903; Packaging: Cut Tape (CT); Series: ERJ; Part Status: Active; Value: 330k; Composition: Thick Film; Features: Automotive AEC-Q200; Operating Temperature: -55°C ~ 155°C; Package / Case: 0603 (1608 Metric); Size / Dimension: 0.063" L x 0.031" W (1.60mm x 0.80mm); Height - Seated (Max): 0.022" (0.55mm); Number of Terminations: 2; Failure Rate: -
R8 = ERJ-3GEYJ103V: RES SMD 10K OHM 5% 1/10W 0603; Manufacturer: Panasonic Electronic Components; Factory Stock: 0; Unit Price (USD): 0.00321; @ qty: 1500; Minimum Quantity: 1; Power (Watts): 0.1W, 1/10W; Temperature Coefficient: ±200ppm/°C; Part Number: ERJ-3GEYJ103V; Datasheets: http://industrial.panasonic.com/www-cgi/jvcr13pz.cgi?E+PZ+3+AOA0001+ERJ3GEYJ103V+7+WW; Image: //media.digikey.com/Photos/Panasonic%20Photos/MFG_ERJ-P6W%20Series.jpg; Digi-Key Part Number: P10KGCT-ND; Quantity Available: 7178118; Packaging: Cut Tape (CT); Series: ERJ; Part Status: Active; Value: 10k; Composition: Thick Film; Features: Automotive AEC-Q200; Operating Temperature: -55°C ~ 155°C; Package / Case: 0603 (1608 Metric); Size / Dimension: 0.063" L x 0.031" W (1.60mm x 0.80mm); Height - Seated (Max): 0.022" (0.55mm); Number of Terminations: 2; Failure Rate: -
R9 = ERJ-3GEYJ473V: RES SMD 47K OHM 5% 1/10W 0603; Manufacturer: Panasonic Electronic Components; Factory Stock: 0; Unit Price (USD): 0.00321; @ qty: 1500; Minimum Quantity: 1; Power (Watts): 0.1W, 1/10W; Temperature Coefficient: ±200ppm/°C; Part Number: ERJ-3GEYJ473V; Datasheets: http://industrial.panasonic.com/www-cgi/jvcr13pz.cgi?E+PZ+3+AOA0001+ERJ3GEYJ473V+7+WW; Image: //media.digikey.com/Photos/Panasonic%20Photos/MFG_ERJ-P6W%20Series.jpg; Digi-Key Part Number: P47KGCT-ND; Quantity Available: 661986; Packaging: Cut Tape (CT); Series: ERJ; Part Status: Active; Value: 47k; Composition: Thick Film; Features: Automotive AEC-Q200; Operating Temperature: -55°C ~ 155°C; Supplier Device Package: 0603; Size / Dimension: 0.063" L x 0.031" W (1.60mm x 0.80mm); Height - Seated (Max): 0.022" (0.55mm); Number of Terminations: 2; Failure Rate: -
R10 = ERJ-3GEYJ564V: RES SMD 560K OHM 5% 1/10W 0603; Manufacturer: Panasonic Electronic Components; Factory Stock: 0; Unit Price (USD): 0.00321; @ qty: 1500; Minimum Quantity: 1; Power (Watts): 0.1W, 1/10W; Temperature Coefficient: ±200ppm/°C; Part Number: ERJ-3GEYJ564V; Datasheets: http://industrial.panasonic.com/www-cgi/jvcr13pz.cgi?E+PZ+3+AOA0001+ERJ3GEYJ564V+7+WW; Image: //media.digikey.com/Photos/Panasonic%20Photos/MFG_ERJ-P6W%20Series.jpg; Digi-Key Part Number: P560KGCT-ND; Quantity Available: 49313; Packaging: Cut Tape (CT); Series: ERJ; Part Status: Active; Value: 560k; Composition: Thick Film; Features: Automotive AEC-Q200; Operating Temperature: -55°C ~ 155°C; Package / Case: 0603 (1608 Metric); Size / Dimension: 0.063" L x 0.031" W (1.60mm x 0.80mm); Height - Seated (Max): 0.022" (0.55mm); Number of Terminations: 2; Failure Rate: -
R11 R20 = POT-0004: Potentiometer, 10k, Linear Taper, 16mm, Single Gang, TH RA; Manufacturer 1: Mammoth; Manufacturer 1 PN: B10K; Tolerance: 5%; Power (Watts): 0.25; TPN: POT-0004; Mounting Type: Through-Hole, Right Angle; Supplier 1: Mammoth Electronics; Supplier Part Number 1: B10K
R12 = ERJ-3GEYJ623V: RES SMD 62K OHM 5% 1/10W 0603; Manufacturer: Panasonic Electronic Components; Factory Stock: 0; Unit Price (USD): 0.00321; @ qty: 1500; Minimum Quantity: 1; Power (Watts): 0.1W, 1/10W; Temperature Coefficient: ±200ppm/°C; Part Number: ERJ-3GEYJ623V; Datasheets: http://industrial.panasonic.com/www-cgi/jvcr13pz.cgi?E+PZ+3+AOA0001+ERJ3GEYJ623V+7+WW; Image: //media.digikey.com/Photos/Panasonic%20Photos/MFG_ERJ-P6W%20Series.jpg; Digi-Key Part Number: P62KGCT-ND; Quantity Available: 62166; Packaging: Cut Tape (CT); Series: ERJ; Part Status: Active; Value: 62k; Composition: Thick Film; Features: Automotive AEC-Q200; Operating Temperature: -55°C ~ 155°C; Package / Case: 0603 (1608 Metric); Size / Dimension: 0.063" L x 0.031" W (1.60mm x 0.80mm); Height - Seated (Max): 0.022" (0.55mm); Number of Terminations: 2; Failure Rate: -
R14 = ERJ-3GEYJ824V: RES SMD 820K OHM 5% 1/10W 0603; Manufacturer: Panasonic Electronic Components; Factory Stock: 0; Unit Price (USD): 0.00321; @ qty: 1500; Minimum Quantity: 1; Power (Watts): 0.1W, 1/10W; Temperature Coefficient: ±200ppm/°C; Part Number: ERJ-3GEYJ824V; Datasheets: http://industrial.panasonic.com/www-cgi/jvcr13pz.cgi?E+PZ+3+AOA0001+ERJ3GEYJ824V+7+WW; Image: //media.digikey.com/Photos/Panasonic%20Photos/MFG_ERJ-P6W%20Series.jpg; Digi-Key Part Number: P820KGCT-ND; Quantity Available: 37901; Packaging: Cut Tape (CT); Series: ERJ; Part Status: Active; Value: 820k; Composition: Thick Film; Features: Automotive AEC-Q200; Operating Temperature: -55°C ~ 155°C; Package / Case: 0603 (1608 Metric); Size / Dimension: 0.063" L x 0.031" W (1.60mm x 0.80mm); Height - Seated (Max): 0.022" (0.55mm); Number of Terminations: 2; Failure Rate: -
R15 R17 = ERJ-3GEYJ122V: RES SMD 1.2K OHM 5% 1/10W 0603; Manufacturer: Panasonic Electronic Components; Factory Stock: 0; Unit Price (USD): 0.00321; @ qty: 1500; Minimum Quantity: 1; Power (Watts): 0.1W, 1/10W; Temperature Coefficient: ±200ppm/°C; Part Number: ERJ-3GEYJ122V; Datasheets: http://industrial.panasonic.com/www-cgi/jvcr13pz.cgi?E+PZ+3+AOA0001+ERJ3GEYJ122V+7+WW; Image: //media.digikey.com/Photos/Panasonic%20Photos/MFG_ERJ-P6W%20Series.jpg; Digi-Key Part Number: P1.2KGCT-ND; Quantity Available: 117934; Packaging: Cut Tape (CT); Series: ERJ; Part Status: Active; Value: 1.2k; Composition: Thick Film; Features: Automotive AEC-Q200; Operating Temperature: -55°C ~ 155°C; Size / Dimension: 0.063" L x 0.031" W (1.60mm x 0.80mm); Height - Seated (Max): 0.022" (0.55mm); Number of Terminations: 2; Failure Rate: -
  R15: Supplier Device Package: 0603
  R17: Package / Case: 0603 (1608 Metric)
R19 = ERJ-3GEYJ822V: RES SMD 8.2K OHM 5% 1/10W 0603; Manufacturer: Panasonic Electronic Components; Factory Stock: 0; Unit Price (USD): 0.00321; @ qty: 1500; Minimum Quantity: 1; Power (Watts): 0.1W, 1/10W; Temperature Coefficient: ±200ppm/°C; Part Number: ERJ-3GEYJ822V; Datasheets: http://industrial.panasonic.com/www-cgi/jvcr13pz.cgi?E+PZ+3+AOA0001+ERJ3GEYJ822V+7+WW; Image: //media.digikey.com/Photos/Panasonic%20Photos/MFG_ERJ-P6W%20Series.jpg; Digi-Key Part Number: P8.2KGCT-ND; Quantity Available: 123890; Packaging: Cut Tape (CT); Series: ERJ; Part Status: Active; Value: 8.2k; Composition: Thick Film; Features: Automotive AEC-Q200; Operating Temperature: -55°C ~ 155°C; Package / Case: 0603 (1608 Metric); Size / Dimension: 0.063" L x 0.031" W (1.60mm x 0.80mm); Height - Seated (Max): 0.022" (0.55mm); Number of Terminations: 2; Failure Rate: -
R21 = POT-0017: Potentiometer, 100k, Log Taper, 16mm, Single Gang, TH RA; Manufacturer 1: Mammoth; Manufacturer 1 PN: B100K; Tolerance: 5%; Power (Watts): 0.25; TPN: POT-0017; Mounting Type: Through-Hole, Right Angle; Supplier 1: Mammoth Electronics; Supplier Part Number 1: A100K
R22 = ERJ-3EKF5231V: RES SMD 5.23K OHM 1% 1/10W 0603; Manufacturer: Panasonic Electronic Components; Factory Stock: 0; Unit Price (USD): 0.00379; @ qty: 1500; Minimum Quantity: 1; Power (Watts): 0.1W, 1/10W; Temperature Coefficient: ±100ppm/°C; Part Number: ERJ-3EKF5231V; Datasheets: http://industrial.panasonic.com/www-cgi/jvcr13pz.cgi?E+PZ+3+AOA0002+ERJ3EKF5231V+7+WW; Image: //media.digikey.com/Photos/Panasonic%20Photos/MFG_ERJ-P6W%20Series.jpg; Digi-Key Part Number: P5.23KHCT-ND; Quantity Available: 49513; Packaging: Cut Tape (CT); Series: ERJ; Part Status: Active; Value: 5.23k; Composition: Thick Film; Features: Automotive AEC-Q200; Operating Temperature: -55°C ~ 155°C; Package / Case: 0603 (1608 Metric); Size / Dimension: 0.063" L x 0.031" W (1.60mm x 0.80mm); Height - Seated (Max): 0.022" (0.55mm); Number of Terminations: 2; Failure Rate: -
R23 = ERJ-3GEYJ474V: RES SMD 470K OHM 5% 1/10W 0603; Manufacturer: Panasonic Electronic Components; Factory Stock: 0; Unit Price (USD): 0.00321; @ qty: 1500; Minimum Quantity: 1; Power (Watts): 0.1W, 1/10W; Temperature Coefficient: ±200ppm/°C; Part Number: ERJ-3GEYJ474V; Datasheets: http://industrial.panasonic.com/www-cgi/jvcr13pz.cgi?E+PZ+3+AOA0001+ERJ3GEYJ474V+7+WW; Image: //media.digikey.com/Photos/Panasonic%20Photos/MFG_ERJ-P6W%20Series.jpg; Digi-Key Part Number: P470KGCT-ND; Quantity Available: 18290; Packaging: Cut Tape (CT); Series: ERJ; Part Status: Active; Value: 470k; Composition: Thick Film; Features: Automotive AEC-Q200; Operating Temperature: -55°C ~ 155°C; Package / Case: 0603 (1608 Metric); Size / Dimension: 0.063" L x 0.031" W (1.60mm x 0.80mm); Height - Seated (Max): 0.022" (0.55mm); Number of Terminations: 2; Failure Rate: -
R24 R25 = RES-SM-0677: RES 0 OHM JUMPER 1/10W 0603; Manufacturer 1: Stackpole Electronics Inc; Manufacturer Part Number 1: RMCF0603ZT0R00; Power Rating: 0.1; Pulse-Rated: No; TPN: RES-SM-0677; Supplier 1: Digi-Key; Supplier Part Number 1: RMCF0603ZT0R00TR-ND; Supplier Link 1: https://www.seielect.com/Catalog/SEI-RMCF_RMCP.pdf; Manufacturer 2: Yageo; Manufacturer Part Number 2: RC0603JR-070RL; Supplier 2: Digi-Key; Supplier Part Number 2: 311-0.0GRTR-ND; DNP: DNP
U1 U3 = UA741CP: General-Purpose Operational Amplifier, 7 to 36 V, 0 to 70 degC, 8-pin DIP (P8), Pb-Free (RoHS); Manufacturer: Texas Instruments; CMRR(Min)(dB): 70; GBW(Typ)(MHz): 1; IIB(Max)(pA): 800000; Iq per channel(Max)(mA): 2.8; Slew Rate(Typ)(V/us): 0.5; Sub Family: General Purpose Amplifier, High Supply Voltage Amplifier (>=30V); Total Supply Voltage(Max)(+5V is 5, +/-5V is 10): 36; Total Supply Voltage(Min)(+5V is 5, +/-5V is 10): 7; Vio (25C)(Max)(mV): 6; DatasheetVersion: SLOS094B; PackageVersion: 4040082/E, 04/2010; PackageReference: P8; PackageDescription: 8-Pin Plastic In-Line, Body 9.59 x 6.35 mm, Pitch 2.54 mm; Supplier 1: Digi-Key; Supplier Part Number 1: 296-11107-5-ND; Supplier 2: Farnell; Supplier Part Number 2: 1564944; Supplier 3: Newark; Supplier Part Number 3: 60K7043; Supplier 4: Mouser; Supplier Part Number 4: 595-UA741CP; Eco-Plan: Pb-Free (RoHS); Number of Channels: 1; Mounting Technology: Through Hole; Code_JEDEC: MS-001; PartNumber: UA741CP; ComponentLink1Description: Manufacturer URL; ComponentLink1URL: http://www.ti.com/; ComponentLink2Description: Datasheet; ComponentLink2URL: http://www.ti.com/lit/ds/symlink/ua741.pdf; ComponentLink3Description: Package Specification; ComponentLink3URL: http://www.ti.com/litv/pdf/mpdi001b
U2 = RC4558P: Dual General-Purpose Operational Amplifier, 10 to 30 V, 0 to 70 degC, 8-pin DIP (P8), Pb-Free (RoHS); Manufacturer: Texas Instruments; CMRR(Min)(dB): 70; GBW(Typ)(MHz): 3; IIB(Max)(pA): 500000; Iq per channel(Max)(mA): 2.8; Number of Channels: 2; Slew Rate(Typ)(V/us): 1.7; Sub Family: General Purpose Amplifier, High Supply Voltage Amplifier (>=30V), Low Noise Amp (<=10nV/rtHz); Total Supply Voltage(Max)(+5V is 5, +/-5V is 10): 30; Total Supply Voltage(Min)(+5V is 5, +/-5V is 10): 10; Vio (25C)(Max)(mV): 6; Vn at 1kHz(Typ)(nV/rtHz): 8; DatasheetVersion: SLOS073F; PackageVersion: 4040082/E, 04/2010; PackageReference: P8; PackageDescription: 8-Pin Plastic In-Line, Body 9.59 x 6.35 mm, Pitch 2.54 mm; Supplier 1: Digi-Key; Supplier Part Number 1: 296-1414-5-ND; Supplier 2: Farnell; Supplier Part Number 2: 1106010; Supplier 3: Newark; Supplier Part Number 3: 60K6767; Supplier 4: Mouser; Supplier Part Number 4: 595-RC4558P; Eco-Plan: Pb-Free (RoHS); Mounting Technology: Through Hole; Code_JEDEC: MS-001; PartNumber: RC4558P; ComponentLink1Description: Manufacturer URL; ComponentLink1URL: http://www.ti.com/; ComponentLink2Description: Datasheet; ComponentLink2URL: http://www.ti.com/lit/ds/symlink/rc4558.pdf; ComponentLink3Description: Package Specification; ComponentLink3URL: http://www.ti.com/litv/pdf/mpdi001b
U4 U5 = NFET-0001: MOSFET N-CH 20V 1A SOT323; Manufacturer: Diodes Incorporated; Gate Charge (Qg) (Max) @ Vgs: 0.74nC @ 4.5V; Input Capacitance (Ciss) (Max) @ Vds: 60.67pF @ 16V; Vgs (Max): 6V; Rds On (Max) @ Id, Vgs: 450 mOhm @ 600mA, 4.5V; Vgs(th) (Max) @ Id: 1V @ 250uA; Drive Voltage (Max Rds On, Min Rds On): 1.8V, 4.5V; TPN: NFET-0001; Type: NFET; Supplier 1: Digi-Key; Supplier 1 Part Number: DMG1012UW-7DICT-ND; Drain to Source Voltage (Vdss): 20V; Gate Charge (Qg) @ Vgs: 0.74nC @ 4.5V; Operating Temperature: -55°C ~ 150°C (TJ); Package / Case: SC-70, SOT-323; ComponentLink1URL: https://www.diodes.com/assets/Datasheets/ds31859.pdf; ComponentLink1Description: Datasheet; ComponentLink2URL: https://www.digikey.com/product-detail/en/diodes-incorporated/DMG1012UW-7/DMG1012UW-7DICT-ND/2183242; ComponentLink2Description: Supplier Link